# Altium schematic sheet KeplerAdvancedVehicleInterface.SchDoc (part 2 of 2)
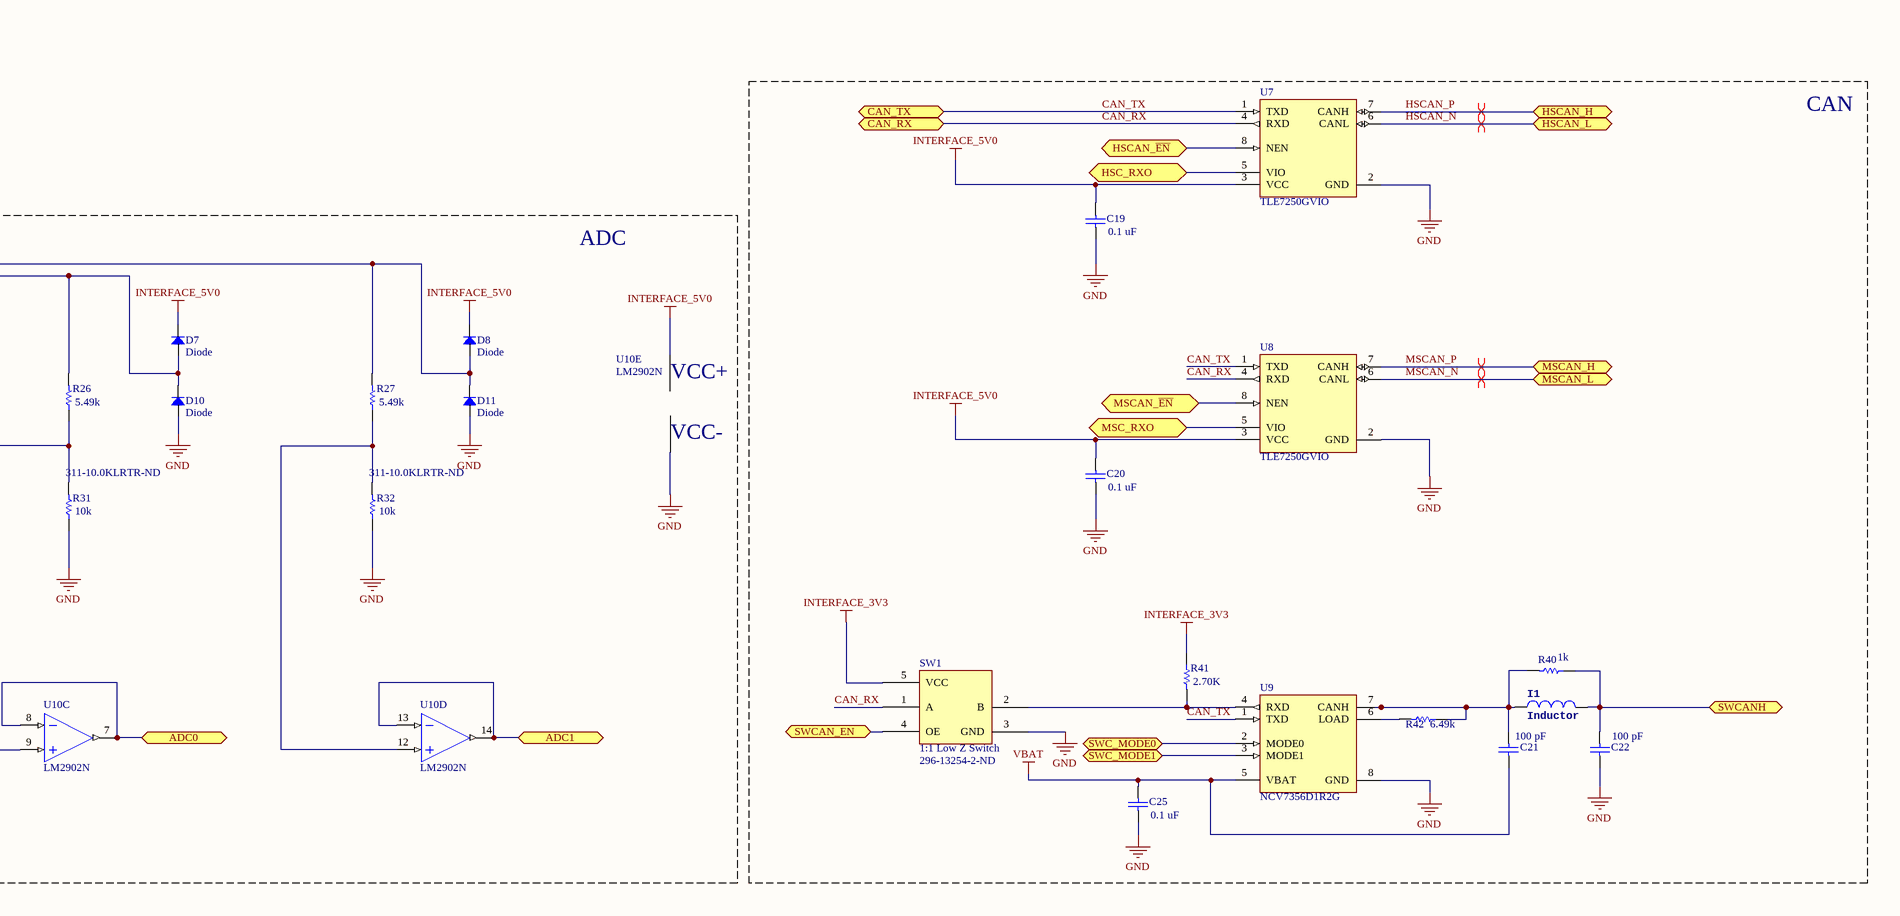
[diagram p4: KeplerAdvancedVehicleInterface.SchDoc, bottom right]

## Library data of the parts
C1-C4 C6-C8 C16 C19 C20 C25 C27 = CMP-1590-00004-1: 0402 (1005 Metric) Chip Capacitor; Manufacturer: Kemet; Manufacturer Part Number: C0402C104K4RACTU; Case-EIA: 0402; Case-Metric: 1005; Capacitance: 0.10µF; Voltage - Rated: 16V; Temperature Coefficient: X7R; PackageReference: CAPC0402(1005)60; Supplier 1: Digi-Key; Supplier Part Number 1: 399-3521-2-ND; RoHS: RoHS Compliant; Category: Capacitors; Stock 1: 4800000; Pricing 1: 10000=0.015, 20000=0.01425, 30000=0.0135, 50000=0.01238, 100000=0.01022 (USD); Packaging: Tape & Reel (TR); Part Status: Active; Operating Temperature: -55°C ~ 125°C; Features: -; Ratings: -; Applications: General Purpose; Failure Rate: -; Mounting Type: Surface Mount, MLCC; Package / Case: 0402 (1005 Metric); Size / Dimension: 0.039" L x 0.020" W (1.00mm x 0.50mm); Height - Seated (Max): -; Thickness (Max): 0.022" (0.55mm); Lead Spacing: -; Lead Style: -; ComponentLink1URL: http://www.kemet.com/docfinder?Partnumber=C0402C104K4RACTU; ComponentLink1Description: http://www.kemet.com/docfinder?Partnumber=C0402C104K4RACTU
C5 C10-C12 C14 C15 C17 C28 = CMP-1590-00003-1: 0805 (2012 Metric) Chip Capacitor; Manufacturer: Samsung Electro-Mechanics America, Inc.; Manufacturer Part Number: CL21B105KPFNNNE; Case-EIA: 0805; Case-Metric: 2012; Capacitance: 1µF; Voltage - Rated: 10V; Temperature Coefficient: X7R; PackageReference: CAPC0805(2012)145; Supplier 1: Digi-Key; Supplier Part Number 1: 1276-1275-2-ND; RoHS: RoHS Compliant; Category: Capacitors; Stock 1: 94000; Pricing 1: 2000=0.01375, 4000=0.01265, 10000=0.01155, 14000=0.011, 50000=0.00935, 100000=0.00756 (USD); Packaging: Tape & Reel (TR); Part Status: Active; Operating Temperature: -55°C ~ 125°C; Features: -; Ratings: -; Applications: General Purpose; Failure Rate: *; Mounting Type: Surface Mount, MLCC; Package / Case: 0805 (2012 Metric); Size / Dimension: 0.079" L x 0.049" W (2.00mm x 1.25mm); Height - Seated (Max): -; Thickness (Max): 0.053" (1.35mm); Lead Spacing: -; Lead Style: -; ComponentLink1URL: http://www.samsungsem.com/kr/support/product-search/mlcc/__icsFiles/afieldfile/2016/08/18/S_CL21B105KPFNNNE.pdf; ComponentLink1Description: http://www.samsungsem.com/kr/support/product-search/mlcc/__icsFiles/afieldfile/2016/08/18/S_CL21B105KPFNNNE.pdf
C9 = CMP-0687-00028-1: Aluminum Electrolytic Capacitor, UD Series, Low Impedance, 22 uF, 25 V, + / - 20%, -55 to 105 degC, Chip Type, 5 x 5.8 mm D x L, Pb-Free, Reel; Manufacturer: Nichicon; Packing: Dia382mm Reel; Rated Ripple Current (at 100kHz): 150 mA; Tolerance Rated Capacitance: -20 to 20%; Endurance Time: 2000 h; Rated Voltage: 25 V; Impedance: 0.76 Ohm; Capacitance: 22µF; Voltage Rating: 25V; Lifetime @ Temp.: 2000 Hrs @ 105°C; Polarization: Polar; Ripple Current: 150mA; Surface Mount Land Size: 0.209" L x 0.209" W (5.30mm x 5.30mm); Value: 22 uF; DatasheetVersion: 08/2012; PackageDescription: 2-Pin Surface Mount Device, Diameter 5 mm, Height 5.8 mm, Pitch 4.4 mm; ComponentLink3URL: http://products.nichicon.co.jp/en/pdf/XJA043/e-ud.pdf; Diameter: 5 mm; PartNumber: UUD1E220MCL1GS; RoHS: TRUE; ComponentLink1Description: Manufacturer URL; Length: 5.8 mm; ComponentLink3Description: Package Specification; ComponentLink2URL: http://products.nichicon.co.jp/en/pdf/XJA043/e-ud.pdf; ComponentLink1URL: http://www.nichicon.co.jp/; PackageReference: CAPAE-D5H5.8; Mounting Technology: Surface Mount; ComponentLink2Description: Datasheet; Supplier 1: Digi-Key; Supplier Part Number 1: 493-2270-2-ND; Manufacturer Part Number: UUD1E220MCL1GS; Category: Capacitors; Stock 1: 17000; Pricing 1: 1000=0.11077, 2000=0.10494, 5000=0.09911, 10000=0.09328, 25000=0.08745, 50000=0.08162, 100000=0.07579 (USD); Packaging: Tape & Reel (TR); Part Status: Active; Tolerance: ±20%; ESR (Equivalent Series Resistance): -; Operating Temperature: -55°C ~ 105°C; Applications: General Purpose; Lead Spacing: -; Size / Dimension: 0.197" Dia (5.00mm); Height - Seated (Max): 0.228" (5.80mm); Mounting Type: Surface Mount; Package / Case: Radial, Can - SMD; ComponentLink4URL: http://nichicon-us.com/english/products/pdfs/e-uud.pdf; ComponentLink4Description: http://nichicon-us.com/english/products/pdfs/e-uud.pdf
C18 = CMP-1590-00004-1: 0402 (1005 Metric) Chip Capacitor; Manufacturer: Kemet; Manufacturer Part Number: C0402C472K5RACTU; Case-EIA: 0402; Case-Metric: 1005; Capacitance: 4700pF; Voltage - Rated: 50V; Temperature Coefficient: X7R; PackageReference: CAPC0402(1005)60; Supplier 1: Digi-Key; Supplier Part Number 1: 399-3072-2-ND; RoHS: RoHS Compliant; Category: Capacitors; Stock 1: 140000; Pricing 1: 10000=0.0042, 20000=0.004, 30000=0.0038, 50000=0.0034, 100000=0.00275 (USD); Packaging: Tape & Reel (TR); Part Status: Active; Operating Temperature: -55°C ~ 125°C; Features: -; Ratings: -; Applications: General Purpose; Failure Rate: -; Mounting Type: Surface Mount, MLCC; Package / Case: 0402 (1005 Metric); Size / Dimension: 0.039" L x 0.020" W (1.00mm x 0.50mm); Height - Seated (Max): -; Thickness (Max): 0.022" (0.55mm); Lead Spacing: -; Lead Style: -; ComponentLink1URL: http://www.kemet.com/docfinder?Partnumber=C0402C472K5RACTU; ComponentLink1Description: http://www.kemet.com/docfinder?Partnumber=C0402C472K5RACTU
C21 C22 = CMP-1590-00005-1: 0603 (1608 Metric) Chip Capacitor; Manufacturer: Kemet; Manufacturer Part Number: C0402C101K5GACTU; Case-Metric: 1608; Case-EIA: 0603; Capacitance: 100pF; Voltage - Rated: 50V; Temperature Coefficient: C0G, NP0; PackageReference: CAPC0603(1608)100; Supplier 1: Digi-Key; Supplier Part Number 1: 399-7750-2-ND; RoHS: RoHS Compliant; Category: Capacitors; Stock 1: 140000; Pricing 1: 10000=0.00378, 20000=0.0036, 30000=0.00342, 50000=0.00306, 100000=0.00248 (USD); Packaging: Tape & Reel (TR); Part Status: Active; Operating Temperature: -55°C ~ 125°C; Features: Low ESL; Ratings: -; Applications: General Purpose; Failure Rate: -; Mounting Type: Surface Mount, MLCC; Package / Case: 0402 (1005 Metric); Size / Dimension: 0.039" L x 0.020" W (1.00mm x 0.50mm); Height - Seated (Max): -; Thickness (Max): 0.022" (0.55mm); Lead Spacing: -; Lead Style: -; ComponentLink1URL: http://www.kemet.com/docfinder?Partnumber=C0402C101K5GACTU; ComponentLink1Description: http://www.kemet.com/docfinder?Partnumber=C0402C101K5GACTU
C23 C24 = CMP-1590-00004-1: 0402 (1005 Metric) Chip Capacitor; Manufacturer: Kemet; Manufacturer Part Number: CBR04C689D5GAC; Case-EIA: 0402; Case-Metric: 1005; Capacitance: 6.8pF; Voltage - Rated: 50V; Temperature Coefficient: C0G, NP0; PackageReference: CAPC0402(1005)60; Supplier 1: Digi-Key; Supplier Part Number 1: 399-6167-2-ND; RoHS: RoHS Compliant; Category: Capacitors; Stock 1: 10000; Pricing 1: 10000=0.01365, 20000=0.013, 30000=0.01235, 50000=0.01105, 100000=0.00894 (USD); Packaging: Tape & Reel (TR); Part Status: Active; Operating Temperature: -55°C ~ 125°C; Features: High Q, Low Loss; Ratings: -; Applications: RF, Microwave, High Frequency; Failure Rate: -; Mounting Type: Surface Mount, MLCC; Package / Case: 0402 (1005 Metric); Size / Dimension: 0.039" L x 0.020" W (1.00mm x 0.50mm); Height - Seated (Max): -; Thickness (Max): 0.022" (0.55mm); Lead Spacing: -; Lead Style: -; ComponentLink1URL: http://www.kemet.com/docfinder?Partnumber=CBR04C689D5GAC; ComponentLink1Description: http://www.kemet.com/docfinder?Partnumber=CBR04C689D5GAC
C29 = CMP-1590-00001-1: 1206 (3216 Metric) Chip Capacitor; Manufacturer: Kemet; Manufacturer Part Number: T491A475K010AT; Manufacturer Size Code: A; Case-Metric: 3216; Case-EIA: 1206; Capacitance: 4.7µF; Voltage - Rated: 10V; Type: Molded; ESR (Equivalent Series Resistance): 5 Ohm; Lifetime @ Temp.: 2000 Hrs @ 85°C; PackageReference: CAPC1206(3216)150; Supplier 1: Digi-Key; Supplier Part Number 1: 399-3696-2-ND; RoHS: RoHS Compliant; Category: Capacitors; Stock 1: 40000; Pricing 1: 2000=0.0756, 4000=0.0714, 10000=0.0672, 14000=0.0651, 50000=0.0588, 100000=0.0546 (USD); Packaging: Tape & Reel (TR); Part Status: Active; Operating Temperature: -55°C ~ 125°C; Mounting Type: Surface Mount; Package / Case: 1206 (3216 Metric); Size / Dimension: 0.126" L x 0.063" W (3.20mm x 1.60mm); Height - Seated (Max): 0.071" (1.80mm); Lead Spacing: -; Features: General Purpose; Failure Rate: -; ComponentLink1URL: http://www.kemet.com/Lists/ProductCatalog/Attachments/254/KEM_T2005_T491.pdf; ComponentLink1Description: http://www.kemet.com/Lists/ProductCatalog/Attachments/254/KEM_T2005_T491.pdf
D1 D4 = CMP-0648-00001-1: High-speed Switching Diode, 100 V, 4 ns, -65 to 150 degC, 3-Pin SOT23, RoHS, Tape and Reel; Manufacturer: NXP Semiconductors; Ptot (mW): 250; VFR (V): 1.75; VRRM (V): 100; Cd (pF): 1.5; Rth (j-t) (K/W): 330; trr (ns): 4; Rth (j-a) (K/W): 500; IF (mA): 215; ComponentLink1Description: Manufacturer URL; DatasheetVersion: Rev. 05; ComponentLink2Description: Datasheet; Temperature Range: -65 to 150 degC; RoHS: TRUE; PackageDescription: 3-Pin Plastic Surface-mounted Package, Body 1.3 x 2.9 mm, Pitch 0.95 mm; Packing: Tape and Reel; PartNumber: BAS16; ComponentLink1URL: http://www.nxp.com/; VR (V): 100; Mounting Technology: Surface Mount; ComponentLink2URL: http://www.nxp.com/documents/data_sheet/BAS16_SER.pdf; PackageReference: SOT23-3; IFRM (mA): 500; Supplier 1: Digi-Key; Supplier Part Number 1: BAS16LT1GOSTR-ND
D2 = TVS: Manufacturer: Vishay Semiconductor Diodes Division; Manufacturer Part Number: SMF18A-E3-08; Type: Zener; Unidirectional Channels: 1; Voltage - Reverse Standoff (Typ): 18V; Voltage - Breakdown (Min): 20V; Voltage - Clamping (Max) @ Ipp: 29.2V; Current - Peak Pulse (10/1000µs): 6.8A; Power - Peak Pulse: 200W; Power Line Protection: No; Capacitance @ Frequency: 320pF @ 1MHz; Supplier 1: Digi-Key; RoHS: RoHS Compliant; Category: Circuit Protection; Stock 1: 18000; Pricing 1: 3000=0.084, 6000=0.0756, 15000=0.0672, 30000=0.063, 75000=0.05586, 150000=0.05376 (USD); Packaging: Tape & Reel (TR); Part Status: Active; Bidirectional Channels: -; Applications: General Purpose; Operating Temperature: -65°C ~ 175°C (TJ); Mounting Type: Surface Mount; Package / Case: DO-219AB; Supplier Device Package: SMF; ComponentLink1URL: http://www.vishay.com/docs/85881/smf5v0atosmf58a.pdf; ComponentLink1Description: http://www.vishay.com/docs/85881/smf5v0atosmf58a.pdf
D5 = ESD_PROTECTION_DIODE: Manufacturer: NXP Semiconductors; Manufacturer Part Number: PRTR5V0U2X,215; Type: Steering (Rail to Rail); Unidirectional Channels: 2; Voltage - Reverse Standoff (Typ): 5.5V (Max); Voltage - Breakdown (Min): 6V; Power Line Protection: Yes; Capacitance @ Frequency: 1pF @ 1MHz; Supplier 1: Digi-Key; RoHS: RoHS Compliant; Category: Circuit Protection; Stock 1: 15000; Pricing 1: 3000=0.17949, 6000=0.16791, 15000=0.15633, 30000=0.14822, 75000=0.14475, 150000=0.13896 (USD); Packaging: Tape & Reel (TR); Part Status: Active; Bidirectional Channels: -; Voltage - Clamping (Max) @ Ipp: -; Current - Peak Pulse (10/1000µs): -; Power - Peak Pulse: -; Applications: General Purpose; Operating Temperature: -40°C ~ 85°C (TA); Mounting Type: Surface Mount; Package / Case: TO-253-4, TO-253AA; Supplier Device Package: SOT-143B; ComponentLink1URL: http://www.nxp.com/documents/data_sheet/PRTR5V0U2X.pdf; ComponentLink1Description: http://www.nxp.com/documents/data_sheet/PRTR5V0U2X.pdf
D6-D11 = Diode: Manufacturer: NXP Semiconductors; Manufacturer Part Number: PMEG2005ET,215; Diode Type: Schottky; Voltage - DC Reverse (Vr) (Max): 20V; Current - Average Rectified (Io): 500mA (DC); Voltage - Forward (Vf) (Max) @ If: 390mV @ 500mA; Speed: Fast Recovery =< 500ns, > 200mA (Io); Current - Reverse Leakage @ Vr: 200µA @ 20V; Capacitance @ Vr, F: 80pF @ 1V, 1MHz; Supplier 1: Digi-Key; Supplier Part Number 1: 568-4111-2-ND; RoHS: RoHS Compliant; Category: Discrete Semiconductor Products; Stock 1: 9000; Pricing 1: 3000=0.09522, 6000=0.08993, 15000=0.082, 30000=0.07671, 75000=0.06877, 150000=0.06613 (USD); Packaging: Tape & Reel (TR); Part Status: Active; Reverse Recovery Time (trr): -; Mounting Type: Surface Mount; Package / Case: TO-236-3, SC-59, SOT-23-3; Supplier Device Package: SOT-23 (TO-236AB); Operating Temperature - Junction: 150°C (Max); ComponentLink1URL: http://www.nxp.com/documents/data_sheet/PMEGXX05ET_SER.pdf; ComponentLink1Description: http://www.nxp.com/documents/data_sheet/PMEGXX05ET_SER.pdf
H1 = Header 5: Header, 5-Pin; LatestRevisionDate: 17-Jul-2002; LatestRevisionNote: Re-released for DXP Platform.; Publisher: Altium Limited
I1 = Inductor: Manufacturer: Taiyo Yuden; Manufacturer Part Number: CB2012T470K; PROD_ID: TRANS-08049; Material - Core: Ferrite; Inductance: 47µH; Tolerance: ±10%; Current Rating: 190mA; Current - Saturation: 90mA; Shielding: Unshielded; DC Resistance (DCR): 4.86 Ohm Max; Frequency - Self Resonant: 11MHz; Frequency - Test: 2.52MHz; Supplier 1: Digi-Key; Supplier Part Number 1: 587-2456-2-ND; RoHS: RoHS Compliant; Category: Inductors, Coils, Chokes; Stock 1: 0; Pricing 1: 3000=0.081, 6000=0.0765, 15000=0.072, 30000=0.06975 (USD); Packaging: Tape & Reel (TR); Part Status: Active; Type: Wirewound; Q @ Freq: -; Ratings: -; Operating Temperature: -40°C ~ 105°C; Mounting Type: Surface Mount; Package / Case: 0805 (2012 Metric); Size / Dimension: 0.079" L x 0.049" W (2.00mm x 1.25mm); Height - Seated (Max): 0.057" (1.45mm); ComponentLink1URL: http://ds.yuden.co.jp/TYCOMPAS/ut/detail.do?productNo=CB2012T470K&fileName=CB2012T470K_SS&mode=specSheetDownload; ComponentLink1Description: http://ds.yuden.co.jp/TYCOMPAS/ut/detail.do?productNo=CB2012T470K&fileName=CB2012T470K_SS&mode=specSheetDownload
J1 = CMP-0397-00002-2: Single USB 2.0, B Type, Right Angle Jack, Through Hole, RoHS, Tube; Manufacturer 1: FCI Electronics; Number of Contacts: 4; Gender: Receptacle; Specifications: USB 2.0; Connector Type: USB-B; ComponentLink1URL: http://portal.fciconnect.com/; DatasheetVersion: Rev. V; Manufacturer Part Number: 61729-0010BLF; ComponentLink3Description: Package Specification; PackageDescription: 6-Pin, Through Hole, Body 12.2 x 16 mm; Packing: Tube; ComponentLink2Description: Datasheet; Mounting Technology: Through Hole; PackageReference: 61729-0010BLF; ComponentLink1Description: Manufacturer URL; ComponentLink3URL: http://portal.fciconnect.com/Comergent//fci/drawing/61729.pdf; ComponentLink2URL: http://portal.fciconnect.com/Comergent//fci/drawing/61729.pdf; RoHS: TRUE
J2 = 90D Male OBD Plug: Manufacturer 1: *; Manufacturer Part Number: *; Supplier 1: *; Supplier Part Number 1: *
J3 = 5X2_MCU_JTAG_PROG: Supplier 1: Digi-Key; Supplier Part Number 1: 609-3695-2-ND
Q1 = ZXMP6A13F: PartNumber: NTR4101PT1G; Manufacturer: On Semiconductor; Manufacturer Part Number: ZXMP6A13FTA; Crss Typ (pF): 75; VGS(th) Max (V): 1.2; Packing: Tape and Reel; VGS Max (V): 8; V(BR)DSS Min (V): 20; Channel Polarity: P Channel; Ciss Typ (pF): 675; Coss Typ (pF): 100; Qrr Typ (nC): 1008; Configuration: Single; ID Max (A): 3.2; FET Type: MOSFET P-Channel, Metal Oxide; FET Feature: Standard; Drain to Source Voltage (Vdss): 60V; Current - Continuous Drain (Id) @ 25°C: 900mA (Ta); Rds On (Max) @ Id, Vgs: 400 mOhm @ 900mA, 10V; Vgs(th) (Max) @ Id: 1V @ 250µA; Gate Charge (Qg) @ Vgs: 5.9nC @ 10V; Input Capacitance (Ciss) @ Vds: 219pF @ 30V; Power - Max: 625mW; ComponentLink2URL: http://www.onsemi.cn/pub_link/Collateral/NTR4101P-D.PDF; Package Type: SOT-23-3; ComponentLink3Description: Package Specification; ComponentLink1Description: Manufacturer URL; PackageDescription: 3-Pin Small Outline Transistor, Body 2.92 x 1.3 mm, Pitch 0.95 mm; ComponentLink3URL: http://www.onsemi.cn/pub_link/Collateral/318-08.PDF; ComponentLink2Description: Datasheet; Mounting Technology: Surface Mount; ComponentLink1URL: http://www.onsemi.com/; PackageVersion: Rev. AP, 11/2009; RoHS: Pb-Free; DatasheetVersion: Rev. 9; PackageReference: SOT-23-3-318-08; Supplier 1: Digi-Key; Category: Discrete Semiconductor Products; Stock 1: 65472; Pricing 1: 1=0.54, 10=0.463, 100=0.3461, 500=0.2719, 1000=0.2101 (USD); Packaging: Cut Tape (CT); Part Status: Active; Operating Temperature: -55°C ~ 150°C (TJ); Mounting Type: Surface Mount; Package / Case: TO-236-3, SC-59, SOT-23-3; Supplier Device Package: SOT-23-3; ComponentLink4URL: http://www.diodes.com/_files/datasheets/ZXMP6A13F.pdf; ComponentLink4Description: http://www.diodes.com/_files/datasheets/ZXMP6A13F.pdf
Q2 = ZXMP6A13F: PartNumber: NTR4101PT1G; Manufacturer: On Semiconductor; Crss Typ (pF): 75; VGS(th) Max (V): 1.2; Packing: Tape and Reel; VGS Max (V): 8; V(BR)DSS Min (V): 20; Channel Polarity: P Channel; Ciss Typ (pF): 675; Coss Typ (pF): 100; Qrr Typ (nC): 1008; Configuration: Single; ID Max (A): 3.2; ComponentLink2URL: http://www.onsemi.cn/pub_link/Collateral/NTR4101P-D.PDF; Package Type: SOT-23-3; ComponentLink3Description: Package Specification; ComponentLink1Description: Manufacturer URL; PackageDescription: 3-Pin Small Outline Transistor, Body 2.92 x 1.3 mm, Pitch 0.95 mm; ComponentLink3URL: http://www.onsemi.cn/pub_link/Collateral/318-08.PDF; ComponentLink2Description: Datasheet; Mounting Technology: Surface Mount; ComponentLink1URL: http://www.onsemi.com/; PackageVersion: Rev. AP, 11/2009; RoHS: Pb-Free; DatasheetVersion: Rev. 9; PackageReference: SOT-23-3-318-08; Supplier 1: Digi-Key
Q3 Q5 = CMP-1048-00538-1: General Purpose Transistor, NPN Silicon, 3-Pin SOT-23, Pb-Free, Tape and Reel; Manufacturer: On Semiconductor; fT Min (MHz): 300; IC Continuous (A): 0.6; ComponentLink3URL: http://www.onsemi.cn/pub_link/Collateral/318-08.PDF; PartNumber: MMBT2222ALT1G; RoHS: TRUE; ComponentLink1URL: http://www.onsemi.com/; ComponentLink3Description: Package Specification; ComponentLink2Description: Datasheet; Mounting Technology: Surface Mount; Packing: Tape and Reel; PackageDescription: 3-Pin Small Outline Transistor, Body 2.92 x 1.3 mm, Pitch 0.95 mm; DatasheetVersion: Rev. 10; PackageReference: SOT-23-3-318-08; ComponentLink2URL: http://www.onsemi.cn/pub_link/Collateral/MMBT2222LT1-D.PDF; Polarity: NPN; PackageVersion: Rev. AP, 11/2009; ComponentLink1Description: Manufacturer URL; Supplier 1: Digi-Key; Supplier Part Number 1: MMBT2222ALT1GOSTR-ND
Q4 = CMP-1058-00767-1: Power MOSFET, 200 mA, 50 V, N-Channel, 3-Pin SOT-23, Pb-Free, Tape and Reel; Manufacturer: On Semiconductor; Manufacturer Part Number: BSS138; PD Max (W): 0.225; Coss Typ (pF): 12; V(BR)DSS Min (V): 50; VGS Max (V): 20; Channel Polarity: N Channel; Configuration: Single; VGS(th) Max (V): 1.5; Ciss Typ (pF): 40; Crss Typ (pF): 3.5; ID Max (A): 0.2; FET Type: MOSFET N-Channel, Metal Oxide; FET Feature: Logic Level Gate; Drain to Source Voltage (Vdss): 50V; Current - Continuous Drain (Id) @ 25°C: 220mA (Ta); Rds On (Max) @ Id, Vgs: 3.5 Ohm @ 220mA, 10V; Vgs(th) (Max) @ Id: 1.5V @ 1mA; Gate Charge (Qg) @ Vgs: 2.4nC @ 10V; Input Capacitance (Ciss) @ Vds: 27pF @ 25V; Power - Max: 360mW; ComponentLink3Description: Package Specification; PackageDescription: 3-Pin Small Outline Transistor, Body 2.92 x 1.3 mm, Pitch 0.95 mm; PackageReference: SOT-23-3-318-08; RoHS: Pb-Free; Mounting Technology: Surface Mount; ComponentLink1Description: Manufacturer URL; ComponentLink2URL: http://www.onsemi.com/pub_link/Collateral/BSS138LT1-D.PDF; ComponentLink2Description: Datasheet; Packing: Tape and Reel; PackageVersion: Rev. AP, 11/2009; PartNumber: BSS138LT1G; Package Type: SOT-23-3; ComponentLink1URL: http://www.onsemi.com/; DatasheetVersion: Rev. 8; ComponentLink3URL: http://www.onsemi.cn/pub_link/Collateral/318-08.PDF; Supplier 1: Digi-Key; Supplier Part Number 1: BSS138TR-ND; Category: Discrete Semiconductor Products; Stock 1: 732000; Pricing 1: 3000=0.03703, 6000=0.0322, 15000=0.02737, 30000=0.02576, 75000=0.02415, 150000=0.02093 (USD); Packaging: Tape & Reel (TR); Part Status: Active; Operating Temperature: -55°C ~ 150°C (TJ); Mounting Type: Surface Mount; Package / Case: TO-236-3, SC-59, SOT-23-3; Supplier Device Package: SOT-23-3; ComponentLink4URL: https://www.fairchildsemi.com/datasheets/BS/BSS138.pdf; ComponentLink4Description: https://www.fairchildsemi.com/datasheets/BS/BSS138.pdf
R1 R3 R4 R9 = CMP-1591-00004-1: 0402 (1005 Metric) Chip Resistor; Case-EIA: 0402; Case-Metric: 1005; PackageReference: RESC0402(1005); Supplier 1: Digi-Key; Supplier Part Number 1: 311-10.0KLRTR-ND
R2 = CMP-1591-00004-1: 0402 (1005 Metric) Chip Resistor; Manufacturer: Yageo; Manufacturer Part Number: RC0402FR-071K5L; Case-EIA: 0402; Case-Metric: 1005; Power (Watts): 0.063W, 1/16W; Temperature Coefficient: ±100ppm/°C; PackageReference: RESC0402(1005); Supplier 1: Digi-Key; Supplier Part Number 1: 311-1.50KLRTR-ND; RoHS: RoHS Compliant; Category: Resistors; Stock 1: 1220000; Pricing 1: 10000=0.00137, 30000=0.0012, 50000=0.0011, 100000=0.00108 (USD); Packaging: Tape & Reel (TR); Part Status: Active; Resistance (Ohms): 1.5k; Composition: Thick Film; Features: Moisture Resistant; Operating Temperature: -55°C ~ 155°C; Package / Case: 0402 (1005 Metric); Supplier Device Package: 0402; Size / Dimension: 0.039" L x 0.020" W (1.00mm x 0.50mm); Height - Seated (Max): 0.016" (0.40mm); Number of Terminations: 2; Failure Rate: -; ComponentLink1URL: http://www.yageo.com/NewPortal/yageodocoutput?fileName=/pdf/R-Chip/PYu-RC_Group_51_RoHS_L_4.pdf; ComponentLink1Description: http://www.yageo.com/NewPortal/yageodocoutput?fileName=/pdf/R-Chip/PYu-RC_Group_51_RoHS_L_4.pdf
R5 R15-R19 = CMP-1591-00004-1: 0402 (1005 Metric) Chip Resistor; Manufacturer: Yageo; Manufacturer Part Number: RC0402FR-0710KL; Case-EIA: 0402; Case-Metric: 1005; Resistance (Ohms): 10k; Power (Watts): 0.063W, 1/16W; Temperature Coefficient: ±100ppm/°C; RoHS: RoHS Compliant; Category: Resistors; Packaging: Tape & Reel (TR); Part Status: Active; Composition: Thick Film; Features: Moisture Resistant; Operating Temperature: -55°C ~ 155°C; Package / Case: 0402 (1005 Metric); Supplier Device Package: 0402; Size / Dimension: 0.039" L x 0.020" W (1.00mm x 0.50mm); Height - Seated (Max): 0.016" (0.40mm); Number of Terminations: 2; Failure Rate: -; ComponentLink1URL: http://www.yageo.com/NewPortal/yageodocoutput?fileName=/pdf/R-Chip/PYu-RC_Group_51_RoHS_L_4.pdf; ComponentLink1Description: http://www.yageo.com/NewPortal/yageodocoutput?fileName=/pdf/R-Chip/PYu-RC_Group_51_RoHS_L_4.pdf; Supplier 1: Digi-Key
  R5 R19: PackageReference: RRESC0402(1005); Supplier Part Number 1: YAG3086TR-ND
  R15-R18: PackageReference: RESC0402(1005); Supplier Part Number 1: 311-68.0KLRTR-ND
R6 R8 R13 R14 R30-R36 R47 = CMP-1591-00004-1: 0402 (1005 Metric) Chip Resistor; Manufacturer: Yageo; Manufacturer Part Number: RC0402FR-0710KL; Case-EIA: 0402; Case-Metric: 1005; Power (Watts): 0.063W, 1/16W; Temperature Coefficient: ±100ppm/°C; PackageReference: RESC0402(1005); Supplier 1: Digi-Key; RoHS: RoHS Compliant; Category: Resistors; Stock 1: 11600000; Pricing 1: 10000=0.00137, 30000=0.0012, 50000=0.0011, 100000=0.00108 (USD); Packaging: Tape & Reel (TR); Part Status: Active; Resistance (Ohms): 10k; Composition: Thick Film; Features: Moisture Resistant; Operating Temperature: -55°C ~ 155°C; Package / Case: 0402 (1005 Metric); Supplier Device Package: 0402; Size / Dimension: 0.039" L x 0.020" W (1.00mm x 0.50mm); Height - Seated (Max): 0.016" (0.40mm); Number of Terminations: 2; Failure Rate: -; ComponentLink1URL: http://www.yageo.com/NewPortal/yageodocoutput?fileName=/pdf/R-Chip/PYu-RC_Group_51_RoHS_L_4.pdf; ComponentLink1Description: http://www.yageo.com/NewPortal/yageodocoutput?fileName=/pdf/R-Chip/PYu-RC_Group_51_RoHS_L_4.pdf
  R6 R8 R13 R14 R33-R36 R47: Supplier Part Number 1: 311-10.0KLRTR-ND
R7 R25-R27 R46 = CMP-1591-00004-1: 0402 (1005 Metric) Chip Resistor; Manufacturer: Yageo; Manufacturer Part Number: RC0402FR-075K49L; Case-EIA: 0402; Case-Metric: 1005; Power (Watts): 0.063W, 1/16W; Temperature Coefficient: ±100ppm/°C; PackageReference: RESC0402(1005); Supplier 1: Digi-Key; Supplier Part Number 1: 311-5.49KLRTR-ND; RoHS: RoHS Compliant; Category: Resistors; Stock 1: 240000; Pricing 1: 10000=0.00137, 30000=0.0012, 50000=0.0011, 100000=0.00108 (USD); Packaging: Tape & Reel (TR); Part Status: Active; Resistance (Ohms): 5.49k; Composition: Thick Film; Features: Moisture Resistant; Operating Temperature: -55°C ~ 155°C; Package / Case: 0402 (1005 Metric); Supplier Device Package: 0402; Size / Dimension: 0.039" L x 0.020" W (1.00mm x 0.50mm); Height - Seated (Max): 0.016" (0.40mm); Number of Terminations: 2; Failure Rate: -; ComponentLink1URL: http://www.yageo.com/NewPortal/yageodocoutput?fileName=/pdf/R-Chip/PYu-RC_Group_51_RoHS_L_4.pdf; ComponentLink1Description: http://www.yageo.com/NewPortal/yageodocoutput?fileName=/pdf/R-Chip/PYu-RC_Group_51_RoHS_L_4.pdf
R10 R40 = CMP-1591-00004-1: 0402 (1005 Metric) Chip Resistor; Manufacturer: Yageo; Manufacturer Part Number: RC0402FR-071KL; Case-EIA: 0402; Case-Metric: 1005; Power (Watts): 0.063W, 1/16W; Temperature Coefficient: ±100ppm/°C; PackageReference: RESC0402(1005); Supplier 1: Digi-Key; Supplier Part Number 1: 311-1.00KLRTR-ND; RoHS: RoHS Compliant; Category: Resistors; Stock 1: 6770000; Pricing 1: 10000=0.00137, 30000=0.0012, 50000=0.0011, 100000=0.00108 (USD); Packaging: Tape & Reel (TR); Part Status: Active; Resistance (Ohms): 1k; Composition: Thick Film; Features: Moisture Resistant; Operating Temperature: -55°C ~ 155°C; Package / Case: 0402 (1005 Metric); Supplier Device Package: 0402; Size / Dimension: 0.039" L x 0.020" W (1.00mm x 0.50mm); Height - Seated (Max): 0.016" (0.40mm); Number of Terminations: 2; Failure Rate: -; ComponentLink1URL: http://www.yageo.com/NewPortal/yageodocoutput?fileName=/pdf/R-Chip/PYu-RC_Group_51_RoHS_L_4.pdf; ComponentLink1Description: http://www.yageo.com/NewPortal/yageodocoutput?fileName=/pdf/R-Chip/PYu-RC_Group_51_RoHS_L_4.pdf
R11 = CMP-1591-00004-1: 0402 (1005 Metric) Chip Resistor; Manufacturer: Yageo; Manufacturer Part Number: RC0402FR-071K2L; Case-EIA: 0402; Case-Metric: 1005; Power (Watts): 0.063W, 1/16W; Temperature Coefficient: ±100ppm/°C; PackageReference: RESC0402(1005); Supplier 1: Digi-Key; Supplier Part Number 1: 311-1.20KLRTR-ND; RoHS: RoHS Compliant; Category: Resistors; Stock 1: 540000; Pricing 1: 10000=0.00137, 30000=0.0012, 50000=0.0011, 100000=0.00108 (USD); Packaging: Tape & Reel (TR); Part Status: Active; Resistance (Ohms): 1.2k; Composition: Thick Film; Features: Moisture Resistant; Operating Temperature: -55°C ~ 155°C; Package / Case: 0402 (1005 Metric); Supplier Device Package: 0402; Size / Dimension: 0.039" L x 0.020" W (1.00mm x 0.50mm); Height - Seated (Max): 0.016" (0.40mm); Number of Terminations: 2; Failure Rate: -; ComponentLink1URL: http://www.yageo.com/NewPortal/yageodocoutput?fileName=/pdf/R-Chip/PYu-RC_Group_51_RoHS_L_4.pdf; ComponentLink1Description: http://www.yageo.com/NewPortal/yageodocoutput?fileName=/pdf/R-Chip/PYu-RC_Group_51_RoHS_L_4.pdf
R12 = CMP-1591-00004-1: 0402 (1005 Metric) Chip Resistor; Manufacturer: Yageo; Manufacturer Part Number: RC0402FR-074K7L; Case-EIA: 0402; Case-Metric: 1005; Power (Watts): 0.063W, 1/16W; Temperature Coefficient: ±100ppm/°C; PackageReference: RESC0402(1005); Supplier 1: Digi-Key; Supplier Part Number 1: 311-4.7KLRTR-ND; RoHS: RoHS Compliant; Category: Resistors; Stock 1: 3880000; Pricing 1: 10000=0.00137, 30000=0.0012, 50000=0.0011, 100000=0.00108 (USD); Packaging: Tape & Reel (TR); Part Status: Active; Resistance (Ohms): 4.7k; Composition: Thick Film; Features: Moisture Resistant; Operating Temperature: -55°C ~ 155°C; Package / Case: 0402 (1005 Metric); Supplier Device Package: 0402; Size / Dimension: 0.039" L x 0.020" W (1.00mm x 0.50mm); Height - Seated (Max): 0.016" (0.40mm); Number of Terminations: 2; Failure Rate: -; ComponentLink1URL: http://www.yageo.com/NewPortal/yageodocoutput?fileName=/pdf/R-Chip/PYu-RC_Group_51_RoHS_L_4.pdf; ComponentLink1Description: http://www.yageo.com/NewPortal/yageodocoutput?fileName=/pdf/R-Chip/PYu-RC_Group_51_RoHS_L_4.pdf
R20 = CMP-1591-00004-1: 0402 (1005 Metric) Chip Resistor; Manufacturer: Yageo; Manufacturer Part Number: RC0402FR-072K2L; Case-EIA: 0402; Case-Metric: 1005; Power (Watts): 0.063W, 1/16W; Temperature Coefficient: ±100ppm/°C; PackageReference: RESC0402(1005); Supplier 1: Digi-Key; Supplier Part Number 1: 311-2.20KLRTR-ND; RoHS: RoHS Compliant; Category: Resistors; Stock 1: 2450000; Pricing 1: 10000=0.00137, 30000=0.0012, 50000=0.0011, 100000=0.00108 (USD); Packaging: Tape & Reel (TR); Part Status: Active; Resistance (Ohms): 2.2k; Composition: Thick Film; Features: Moisture Resistant; Operating Temperature: -55°C ~ 155°C; Package / Case: 0402 (1005 Metric); Supplier Device Package: 0402; Size / Dimension: 0.039" L x 0.020" W (1.00mm x 0.50mm); Height - Seated (Max): 0.016" (0.40mm); Number of Terminations: 2; Failure Rate: -; ComponentLink1URL: http://www.yageo.com/NewPortal/yageodocoutput?fileName=/pdf/R-Chip/PYu-RC_Group_51_RoHS_L_4.pdf; ComponentLink1Description: http://www.yageo.com/NewPortal/yageodocoutput?fileName=/pdf/R-Chip/PYu-RC_Group_51_RoHS_L_4.pdf
R21 R22 = CMP-1591-00004-1: 0402 (1005 Metric) Chip Resistor; Manufacturer: Yageo; Manufacturer Part Number: RC0402FR-0739RL; Case-EIA: 0402; Case-Metric: 1005; Resistance (Ohms): 39; Power (Watts): 0.063W, 1/16W; Temperature Coefficient: ±100ppm/°C; PackageReference: RESC0402(1005); Supplier 1: Digi-Key; Supplier Part Number 1: 311-39.0LRTR-ND; RoHS: RoHS Compliant; Category: Resistors; Stock 1: 990000; Pricing 1: 10000=0.00137, 30000=0.0012, 50000=0.0011, 100000=0.00108 (USD); Packaging: Tape & Reel (TR); Part Status: Active; Composition: Thick Film; Features: Moisture Resistant; Operating Temperature: -55°C ~ 155°C; Package / Case: 0402 (1005 Metric); Supplier Device Package: 0402; Size / Dimension: 0.039" L x 0.020" W (1.00mm x 0.50mm); Height - Seated (Max): 0.016" (0.40mm); Number of Terminations: 2; Failure Rate: -; ComponentLink1URL: http://www.yageo.com/NewPortal/yageodocoutput?fileName=/pdf/R-Chip/PYu-RC_Group_51_RoHS_L_4.pdf; ComponentLink1Description: http://www.yageo.com/NewPortal/yageodocoutput?fileName=/pdf/R-Chip/PYu-RC_Group_51_RoHS_L_4.pdf
R23 = CMP-1591-00004-1: 0402 (1005 Metric) Chip Resistor; Manufacturer: Yageo; Manufacturer Part Number: RC0402FR-071ML; Case-EIA: 0402; Case-Metric: 1005; Power (Watts): 0.063W, 1/16W; Temperature Coefficient: ±100ppm/°C; PackageReference: RESC0402(1005); Supplier 1: Digi-Key; Supplier Part Number 1: 311-1.00MLRTR-ND; RoHS: RoHS Compliant; Category: Resistors; Stock 1: 3370000; Pricing 1: 10000=0.00137, 30000=0.0012, 50000=0.0011, 100000=0.00108 (USD); Packaging: Tape & Reel (TR); Part Status: Active; Resistance (Ohms): 1M; Composition: Thick Film; Features: Moisture Resistant; Operating Temperature: -55°C ~ 155°C; Package / Case: 0402 (1005 Metric); Supplier Device Package: 0402; Size / Dimension: 0.039" L x 0.020" W (1.00mm x 0.50mm); Height - Seated (Max): 0.016" (0.40mm); Number of Terminations: 2; Failure Rate: -; ComponentLink1URL: http://www.yageo.com/NewPortal/yageodocoutput?fileName=/pdf/R-Chip/PYu-RC_Group_51_RoHS_L_4.pdf; ComponentLink1Description: http://www.yageo.com/NewPortal/yageodocoutput?fileName=/pdf/R-Chip/PYu-RC_Group_51_RoHS_L_4.pdf
R24 R28 R29 R37-R39 R43-R45 = CMP-1591-00004-1: 0402 (1005 Metric) Chip Resistor; Manufacturer: Yageo; Manufacturer Part Number: RC0402JR-07330RL; Case-EIA: 0402; Case-Metric: 1005; Resistance (Ohms): 330; Power (Watts): 0.063W, 1/16W; Temperature Coefficient: ±100ppm/°C; PackageReference: RESC0402(1005); Supplier 1: Digi-Key; Supplier Part Number 1: 311-330JRTR-ND; RoHS: RoHS Compliant; Category: Resistors; Stock 1: 850000; Pricing 1: 10000=0.00121, 30000=0.00106, 50000=0.00097, 100000=0.00095 (USD); Packaging: Tape & Reel (TR); Part Status: Active; Composition: Thick Film; Features: Moisture Resistant; Operating Temperature: -55°C ~ 155°C; Package / Case: 0402 (1005 Metric); Supplier Device Package: 0402; Size / Dimension: 0.039" L x 0.020" W (1.00mm x 0.50mm); Height - Seated (Max): 0.016" (0.40mm); Number of Terminations: 2; Failure Rate: -; ComponentLink1URL: http://www.yageo.com/NewPortal/yageodocoutput?fileName=/pdf/R-Chip/PYu-RC_Group_51_RoHS_L_4.pdf; ComponentLink1Description: http://www.yageo.com/NewPortal/yageodocoutput?fileName=/pdf/R-Chip/PYu-RC_Group_51_RoHS_L_4.pdf
R41 = CMP-1591-00004-1: 0402 (1005 Metric) Chip Resistor; Manufacturer: Yageo; Manufacturer Part Number: RC0402FR-072K7L; Case-EIA: 0402; Case-Metric: 1005; Resistance (Ohms): 2.7k; Power (Watts): 0.063W, 1/16W; Temperature Coefficient: ±100ppm/°C; PackageReference: RESC0402(1005); Supplier 1: Digi-Key; Supplier Part Number 1: 311-2.70KLRTR-ND; RoHS: RoHS Compliant; Category: Resistors; Stock 1: 470000; Pricing 1: 10000=0.00137, 30000=0.0012, 50000=0.0011, 100000=0.00108 (USD); Packaging: Tape & Reel (TR); Part Status: Active; Composition: Thick Film; Features: Moisture Resistant; Operating Temperature: -55°C ~ 155°C; Package / Case: 0402 (1005 Metric); Supplier Device Package: 0402; Size / Dimension: 0.039" L x 0.020" W (1.00mm x 0.50mm); Height - Seated (Max): 0.016" (0.40mm); Number of Terminations: 2; Failure Rate: -; ComponentLink1URL: http://www.yageo.com/NewPortal/yageodocoutput?fileName=/pdf/R-Chip/PYu-RC_Group_51_RoHS_L_4.pdf; ComponentLink1Description: http://www.yageo.com/NewPortal/yageodocoutput?fileName=/pdf/R-Chip/PYu-RC_Group_51_RoHS_L_4.pdf
R42 = CMP-1591-00004-1: 0402 (1005 Metric) Chip Resistor; Manufacturer: Yageo; Manufacturer Part Number: RC0402FR-076K49L; Case-EIA: 0402; Case-Metric: 1005; Power (Watts): 0.063W, 1/16W; Temperature Coefficient: ±100ppm/°C; PackageReference: RESC0402(1005); Supplier 1: Digi-Key; Supplier Part Number 1: 311-6.49KLRTR-ND; RoHS: RoHS Compliant; Category: Resistors; Stock 1: 340000; Pricing 1: 10000=0.00137, 30000=0.0012, 50000=0.0011, 100000=0.00108 (USD); Packaging: Tape & Reel (TR); Part Status: Active; Resistance (Ohms): 6.49k; Composition: Thick Film; Features: Moisture Resistant; Operating Temperature: -55°C ~ 155°C; Package / Case: 0402 (1005 Metric); Supplier Device Package: 0402; Size / Dimension: 0.039" L x 0.020" W (1.00mm x 0.50mm); Height - Seated (Max): 0.016" (0.40mm); Number of Terminations: 2; Failure Rate: -; ComponentLink1URL: http://www.yageo.com/NewPortal/yageodocoutput?fileName=/pdf/R-Chip/PYu-RC_Group_51_RoHS_L_4.pdf; ComponentLink1Description: http://www.yageo.com/NewPortal/yageodocoutput?fileName=/pdf/R-Chip/PYu-RC_Group_51_RoHS_L_4.pdf
RGB1-RGB3 = RGB_LED: Supplier 1: Digi-Key
SW1 = Signal Switch 1:1: Supplier 1: Digi-Key
U1 = AP2204: Manufacturer: Diodes Incorporated; Manufacturer Part Number: AP2204K-5.0TRG1; Regulator Topology: Positive Fixed; Voltage - Output: 5V; Current - Output: 150mA; Voltage - Dropout (Typical): 0.36V @ 150mA; Number of Regulators: 1; Voltage - Input: Up to 24V; Supplier 1: Digi-Key; RoHS: RoHS Compliant; Category: Integrated Circuits (ICs); Stock 1: 9000; Pricing 1: 3000=0.12359, 6000=0.1161, 15000=0.10861, 30000=0.09962, 75000=0.09587, 150000=0.09213 (USD); Packaging: Tape & Reel (TR); Part Status: Active; Current - Limit (Min): -; Operating Temperature: -40°C ~ 85°C; Mounting Type: Surface Mount; Package / Case: SC-74A, SOT-753; Supplier Device Package: SOT-23-5; ComponentLink1URL: http://www.diodes.com/_files/datasheets/AP2204.pdf; ComponentLink1Description: http://www.diodes.com/_files/datasheets/AP2204.pdf
U2 = AP2204: Manufacturer: Diodes Incorporated; Manufacturer Part Number: AP2204K-3.3TRG1; Regulator Topology: Positive Fixed; Voltage - Output: 3.3V; Current - Output: 150mA; Voltage - Dropout (Typical): 0.36V @ 150mA; Number of Regulators: 1; Voltage - Input: Up to 24V; Supplier 1: Digi-Key; RoHS: RoHS Compliant; Category: Integrated Circuits (ICs); Stock 1: 9000; Pricing 1: 3000=0.12359, 6000=0.1161, 15000=0.10861, 30000=0.09962, 75000=0.09587, 150000=0.09213 (USD); Packaging: Tape & Reel (TR); Part Status: Active; Current - Limit (Min): -; Operating Temperature: -40°C ~ 85°C; Mounting Type: Surface Mount; Package / Case: SC-74A, SOT-753; Supplier Device Package: SOT-23-5; ComponentLink1URL: http://www.diodes.com/_files/datasheets/AP2204.pdf; ComponentLink1Description: http://www.diodes.com/_files/datasheets/AP2204.pdf
U3 = AP2204_ADJ: Manufacturer: Diodes Incorporated; Manufacturer Part Number: AP2204K-ADJTRG1; Regulator Topology: Positive Adjustable; Voltage - Output: 1.24 V ~ 22 V; Current - Output: 150mA; Voltage - Dropout (Typical): 0.36V @ 150mA; Number of Regulators: 1; Voltage - Input: 2.3 V ~ 24 V; Supplier 1: Digi-Key; Supplier Part Number 1: AP2204K-ADJTRG1DICT-ND; RoHS: RoHS Compliant; Category: Integrated Circuits (ICs); Stock 1: 6787; Pricing 1: 1=0.45, 10=0.363, 100=0.2469, 500=0.18516, 1000=0.13887 (USD); Packaging: Cut Tape (CT); Part Status: Active; Current - Limit (Min): -; Operating Temperature: -40°C ~ 85°C; Mounting Type: Surface Mount; Package / Case: SC-74A, SOT-753; Supplier Device Package: SOT-23-5; ComponentLink1URL: http://www.diodes.com/_files/datasheets/AP2204.pdf; ComponentLink1Description: http://www.diodes.com/_files/datasheets/AP2204.pdf
U4 = CMP-1305-00048-1: Low Offset Voltage Dual Comparators, 2 to 36 V, 0 to 70 degC, 8-Pin SOIC, Pb-Free, Tape and Reel; Manufacturer: On Semiconductor; VCC Min (V): 2; VCC Max (V): 36; ICC Typ (mA): 0.4; IO Typ (mA): 16; ComponentLink1Description: Manufacturer URL; ComponentLink2Description: Datasheet; Packing: Tape and Reel; PackageVersion: Rev. AK, 02/2011; RoHS: TRUE; Mounting Technology: Surface Mount; ComponentLink3URL: http://www.onsemi.com/pub_link/Collateral/751-07.PDF; PackageReference: SOIC-8-751-07; PackageDescription: 8-Pin Small Outline Integrated Circuit, Body 4.9 x 3.9 mm, Pitch 1.27 mm; ComponentLink3Description: Package Specification; ComponentLink1URL: http://www.onsemi.com/; PartNumber: LM393DR2G; DatasheetVersion: Rev. 25; ComponentLink2URL: http://www.onsemi.com/pub_link/Collateral/LM393-D.PDF; Supplier 1: Digi-Key; Supplier Part Number 1: LM393DR2GOSTR-ND
U5#1 = CMP-0076-00163-1: AT91 ARM Cortex-M4 32-bit Microcontroller, 512 KB Flash, 128 KB SRAM, 79 User I/Os, -40 to 85 degC, 100-Pin LQFP, RoHS, Tray; Manufacturer: Atmel; Frequency: 120 MHz; Flash: 512 KB; EMAC: 1; User I/Os: 79; SRAM: 128 KB; I2C: 2; SPI: 3; USART: 4; Core Processor: ARM® Cortex®-M4; Speed: 120MHz; Connectivity: CAN, Ethernet, IrDA, MMC/SD, SPI, UART/USART, USB; Peripherals: Brown-out Detect/Reset, DMA, POR, PWM, WDT; Program Memory Size: 512KB (512K x 8); RAM Size: 128K x 8; Voltage - Supply (Vcc/Vdd): 1.62 V ~ 3.6 V; Data Converters: A/D 16x12b, D/A 2x12b; Oscillator Type: Internal; PackageVersion: Rev. A; PackageReference: LQFP-100; ComponentLink3Description: Package Specification; ComponentLink1URL: http://www.atmel.com/; PackageDescription: 100-Pin Low Profile Quad Flat Pack, Body 14 x 14 mm, Pitch 0.5 mm; ComponentLink2Description: Datasheet; ComponentLink2URL: http://www.atmel.com/Images/Atmel_11157_32-bit-Cortex-M4-Microcontroller_SAM4E_Datasheet.pdf; CAN: 1; ComponentLink1Description: Manufacturer URL; Mounting Technology: Surface Mount; Packing: Tray; Operating Temperature Range: -40 to 85 degC; DatasheetVersion: Jul-13; PartNumber: ATSAM4E8CA-AU; RoHS: TRUE; ComponentLink3URL: http://www.atmel.com/Images/Atmel_11157_32-bit-Cortex-M4-Microcontroller_SAM4E_Datasheet.pdf; Supplier 1: Digi-Key; Supplier Part Number 1: ATSAM4E8CA-AU-ND; Manufacturer Part Number: ATSAM4E8CA-AU; Category: Integrated Circuits (ICs); Stock 1: 441; Pricing 1: 1=6.3, 25=5.7268, 100=5.1912 (USD); Packaging: Tray; Part Status: Active; Core Size: 32-Bit; Number of I/O: 79; Program Memory Type: FLASH; EEPROM Size: -; Operating Temperature: -40°C ~ 85°C (TA); Package / Case: 100-LQFP; Supplier Device Package: 100-LQFP (14x14); ComponentLink4URL: http://media.digikey.com/pdf/Data%20Sheets/Atmel%20PDFs/ATSAM4E16E(C),8E(C).pdf; ComponentLink4Description: http://media.digikey.com/pdf/Data%20Sheets/Atmel%20PDFs/ATSAM4E16E(C),8E(C).pdf
U5#2 = CMP-0076-00163-1: AT91 ARM Cortex-M4 32-bit Microcontroller, 512 KB Flash, 128 KB SRAM, 79 User I/Os, -40 to 85 degC, 100-Pin LQFP, RoHS, Tray; Manufacturer: Atmel; Frequency: 120 MHz; Flash: 512 KB; EMAC: 1; User I/Os: 79; SRAM: 128 KB; I2C: 2; SPI: 3; USART: 4; PackageVersion: Rev. A; PackageReference: LQFP-100; ComponentLink3Description: Package Specification; ComponentLink1URL: http://www.atmel.com/; PackageDescription: 100-Pin Low Profile Quad Flat Pack, Body 14 x 14 mm, Pitch 0.5 mm; ComponentLink2Description: Datasheet; ComponentLink2URL: http://www.atmel.com/Images/Atmel_11157_32-bit-Cortex-M4-Microcontroller_SAM4E_Datasheet.pdf; CAN: 1; ComponentLink1Description: Manufacturer URL; Mounting Technology: Surface Mount; Packing: Tray; Operating Temperature Range: -40 to 85 degC; DatasheetVersion: Jul-13; PartNumber: ATSAM4E8CA-AU; RoHS: TRUE; ComponentLink3URL: http://www.atmel.com/Images/Atmel_11157_32-bit-Cortex-M4-Microcontroller_SAM4E_Datasheet.pdf
U6 = CMP-0074-00570-3: Precision Micropower Shunt Voltage Reference, 3-pin SOT-23; Manufacturer: Texas Instruments; Manufacturer Part Number: LM4040CIM3-2.5/NOPB; PackageTopMarking: R2C*XTT; CompType: Voltage Reference IC; PowerWise: N; Output Type: Fixed; Voltage - Output (Min/Fixed): 2.5V; Current - Output: 15mA; Tolerance: ±0.5%; Temperature Coefficient: 100ppm/°C; Noise - 10Hz to 10kHz: 35µVrms; Current - Cathode: 65µA; RevisionNote: Component URLs added; PinCount: 3; PackageDescription: Molded SOT-23, .115 x .051 x .037in Body, 3 Lead, .075 in Pitch; ComponentLink1URL: http://www.ti.com/general/docs/lit/getliterature.tsp?genericPartNumber=LM4040-N&fileType=pdf; DatasheetVersion: Apr-2005; PackageReference: DBZ0003A; PackageVersion: revB, Mar-2003; ComponentLink1Description: Datasheet URL; RoHS: N; Supplier 1: Digi-Key; Supplier Part Number 1: LM4040CIM3-2.5/NOPBTR-ND; Category: Integrated Circuits (ICs); Stock 1: 15000; Pricing 1: 1000=0.3792, 2000=0.34365, 5000=0.31995, 10000=0.3081, 25000=0.29625 (USD); Packaging: Tape & Reel (TR); Part Status: Active; Reference Type: Shunt; Voltage - Output (Max): -; Noise - 0.1Hz to 10Hz: -; Voltage - Input: -; Current - Supply: -; Operating Temperature: -40°C ~ 85°C (TA); Mounting Type: Surface Mount; Package / Case: TO-236-3, SC-59, SOT-23-3; Supplier Device Package: SOT-23-3; ComponentLink2URL: http://www.ti.com/lit/ds/symlink/lm4040-n.pdf; ComponentLink2Description: http://www.ti.com/lit/ds/symlink/lm4040-n.pdf
U7 U8 = CMP-1092-00007-1: High Speed CAN-Transceiver, 1 Mbit/s Transmission Rate, PG-DSO-8-16, Reel, Green; Manufacturer: Infineon; Bus Wake-up capability: FALSE; Standards: ISO11898-2; Quiescent Current (max.): < 15 uA @ 5V standby; Green: TRUE; Wake-up inputs: no; Protocol: CAN; Number of Drivers/Receivers: 1/1; Duplex: Half; Receiver Hysteresis: 100mV; Data Rate: 1Mbps; Voltage - Supply: 4.75 V ~ 5.25 V; ComponentLink2Description: Datasheet; PackageDescription: 8-Pin Plastic (Green) Dual Small Outline Package, 4.9 x 3.9 mm Body, 1.27 mm Pitch; Packing: Reel; ComponentLink3URL: http://www.infineon.com/dgdl/TLE7259-2GE_DS_rev12.pdf?folderId=db3a3043163797a6011666d32a0c0de1&fileId=db3a3043163797a6011666d4dbb80de2&location=en.Products.Automotive_ICs.Automotive_Transceivers.LIN_Transceivers.DATASHEET.TLE7259-2GE_DS_rev12.pdf; PackageReference: PG-DSO-8-16; PartNumber: TLE7250GVIO; Group: High Speed; DatasheetVersion: Rev. 1.0; ComponentLink2URL: http://www.infineon.com/dgdl/TLE7250GVIO_DS_Rev10.pdf?folderId=db3a30431ed1d7b2011edadb13813703&fileId=db3a304336415dec01364ec231567381&location=en.Products.Automotive_ICs.Automotive_Transceivers.CAN_Transceivers.DATASHEET.TLE7250GVIO_DS_Rev10.pdf; Halogen-free: TRUE; ComponentLink3Description: Package Specification; ComponentLink1Description: Manufacturer URL; ComponentLink1URL: http://www.infineon.com/; PackageVersion: Mar-07; Mounting Technology: Surface Mount; Transmission rate max: 1 Mbit/s; Supplier 1: Digi-Key; Supplier Part Number 1: TLE7250GVIOTR-ND; Manufacturer Part Number: TLE7250GVIO; RoHS: RoHS Compliant; Category: Integrated Circuits (ICs); Stock 1: 2500; Pricing 1: 2500=0.6854, 5000=0.66001, 12500=0.63462, 25000=0.62447, 62500=0.60924 (USD); Packaging: Tape & Reel (TR); Part Status: Active; Type: Transceiver; Operating Temperature: -; Mounting Type: Surface Mount; Package / Case: 8-SOIC (0.154", 3.90mm Width); Supplier Device Package: PG-DSO-8; ComponentLink4URL: http://www.infineon.com/dgdl/Infineon-TLE7250GVIO-DS-v01_01-EN.pdf?fileId=5546d46250cc1fdf01516239cdc97170&ack=t; ComponentLink4Description: http://www.infineon.com/dgdl/Infineon-TLE7250GVIO-DS-v01_01-EN.pdf?fileId=5546d46250cc1fdf01516239cdc97170&ack=t
U9 = CMP-1313-00064-1: Single Wire CAN Transceiver, 5 to 27 V, 8-Pin SOIC, Pb-Free, Tape and Reel; Manufacturer: On Semiconductor; Number of Drivers: 1; VCC Min (V): 5; VCC Max (V): 27; Data Rate: 100 kbps; Number of Drivers/Receivers: 1/1; Duplex: Half; Voltage - Supply: 5 V ~ 27 V; ComponentLink3Description: Package Specification; PartNumber: NCV7356D1R2G; Mounting Technology: Surface Mount; ComponentLink2Description: Datasheet; ComponentLink1Description: Manufacturer URL; ComponentLink2URL: http://www.onsemi.com/pub_link/Collateral/NCV7356-D.PDF; PackageVersion: Rev. AK, 02/2011; RoHS: TRUE; PackageReference: SOIC-8-751-07; ComponentLink1URL: http://www.onsemi.com/; Number of Receivers: 1; Packing: Tape and Reel; DatasheetVersion: Rev. 9; PackageDescription: 8-Pin Small Outline Integrated Circuit, Body 4.9 x 3.9 mm, Pitch 1.27 mm; Data Transmission Standard: CAN; ComponentLink3URL: http://www.onsemi.com/pub_link/Collateral/751-07.PDF; Supplier 1: Digi-Key; Supplier Part Number 1: NCV7356D1R2GOSTR-ND; Manufacturer Part Number: NCV7356D1R2G; Category: Integrated Circuits (ICs); Stock 1: 2500; Pricing 1: 2500=0.644, 5000=0.6118, 12500=0.5888, 25000=0.5704, 62500=0.552 (USD); Packaging: Tape & Reel (TR); Part Status: Active; Type: Transceiver; Protocol: CAN; Receiver Hysteresis: -; Operating Temperature: -40°C ~ 150°C; Mounting Type: Surface Mount; Package / Case: 8-SOIC (0.154", 3.90mm Width); Supplier Device Package: 8-SOIC
U10 = AMP-OPA-LM124-14: Low Power Quad Operational Amplifier, 14-pin MDIP; Manufacturer: Texas Instruments; Manufacturer Part Number: LM2902Q4T; PowerWise: N; CompType: Amplifiers; PackageTopMarking: NSUZXYYTTE#*LM2902N; Amplifier Type: General Purpose; Number of Circuits: 4; Slew Rate: 0.4 V/µs; Gain Bandwidth Product: 1.3MHz; Current - Input Bias: 20nA; Voltage - Input Offset: 2mV; Current - Supply: 1.5mA; Current - Output / Channel: 20mA; Voltage - Supply, Single/Dual (±): 3 V ~ 30 V, ±1.5 V ~ 15 V; Package Reference: N0014A; PinCount: 14; PackageDescription: MDIP, .750 x .250 x.130in, 14 Lead, .100in Pitch; Code_JEDEC: MS-001-AA; RoHS: N; ComponentLink1Description: Datasheet URL; ComponentLink1URL: http://www.ti.com/general/docs/lit/getliterature.tsp?genericPartNumber=LM2902&fileType=pdf; Supplier 1: Digi-Key; Supplier Part Number 1: 497-12417-1-ND; Category: Integrated Circuits (ICs); Stock 1: 8705; Pricing 1: 1=0.48, 10=0.358, 100=0.2231, 500=0.15264, 1000=0.11742 (USD); Packaging: Cut Tape (CT); Part Status: Active; Output Type: -; -3db Bandwidth: -; Operating Temperature: -40°C ~ 125°C; Mounting Type: Surface Mount; Package / Case: 16-VFQFN Exposed Pad; Supplier Device Package: 16-QFN (3x3); ComponentLink2URL: http://www.st.com/content/ccc/resource/technical/document/datasheet/c7/ba/36/ca/0c/06/4e/4c/CD00000533.pdf/files/CD00000533.pdf/jcr:content/translations/en.CD00000533.pdf; ComponentLink2Description: http://www.st.com/content/ccc/resource/technical/document/datasheet/c7/ba/36/ca/0c/06/4e/4c/CD00000533.pdf/files/CD00000533.pdf/jcr:content/translations/en.CD00000533.pdf
W1 = BGM111: Manufacturer: Silicon Labs; Manufacturer Part Number: BGM111A256V1; PROD_ID: TRANS-08049; Protocol: Bluetooth v4.1; Frequency: 2.4GHz; Data Rate: 1Mbps; Power - Output: 9dBm; Sensitivity: -93dBm; Serial Interfaces: I²C, SPI, UART; Antenna Type: Integrated, Chip; Memory Size: 256kB Flash, 32kB RAM; Voltage - Supply: 1.8 V ~ 3.8 V; Current - Receiving: 7.5mA; Current - Transmitting: 8.2mA; Supplier 1: Digi-Key; Supplier Part Number 1: BGM111A256V1-ND; RoHS: Request Inventory Verification; Category: RF/IF and RFID; Stock 1: 10; Pricing 1: 1=11.01, 25=9.1732, 100=8.387, 1000=6.97173 (USD); Packaging: Tube; Part Status: Active; RF Family/Standard: Bluetooth; Modulation: -; Mounting Type: Surface Mount; Operating Temperature: -40°C ~ 85°C; Package / Case: 31-SMD Module; ComponentLink1URL: http://www.silabs.com/Support%20Documents/RegisteredDocs/BGM111_DataSheet.pdf; ComponentLink1Description: http://www.silabs.com/Support%20Documents/RegisteredDocs/BGM111_DataSheet.pdf
XC1 = Chrystal: PROD_ID: TRANS-08049; Supplier 1: Digi-Key; Supplier Part Number 1: 631-1023-2-ND
µSD1 = MicroSD_Wellco: microSD memory card connector, push/push; PartGroup: Mechanical devices,Connectors,Memory cards; Manufacturer: Wellco T&C CO., Ltd; MPN: MSPR09-A0-5200; Manufacturer Part Number: 5033981892; AN: A08-1884; ComponentStatus: 'Active (verified)'; Value: MSPR09-A0-5200; Card Type: microSD™; Number of Positions: 9 (8 + 1); Connector Type: Connector and Ejector; Insertion, Removal Method: Push In, Push Out; Status: verified; Design comment: *; Verified by: gsk; Verified date: 13-09-13; Height: 1.75; FootprintStatus: 'Active (Verified)'; Supplier 1: Digi-Key; RoHS: RoHS Compliant; Category: Connectors, Interconnects; Stock 1: 3036; Pricing 1: 1=2.97, 10=2.853, 25=2.6152, 50=2.4962, 100=2.3773, 250=2.08016, 500=2.02072, 1000=1.72356 (USD); Packaging: Cut Tape (CT); Part Status: Active; Ejector Side: -; Mounting Type: Surface Mount, Right Angle; Features: Switch; Height Above Board: 0.050" (1.28mm); Mounting Feature: Normal, Standard - Top; Contact Finish: Gold; Contact Finish Thickness: 19.7µin (0.50µm); ComponentLink1URL: http://www.molex.com/pdm_docs/sd/5033981892_sd.pdf; ComponentLink1Description: http://www.molex.com/pdm_docs/sd/5033981892_sd.pdf
ADC1 = ADConnector4PIN: Supplier 1: Digikey
D3 = Diode: Supplier 1: Digi-Key